# EAGLE design ds3231m-breakout (EAGLE 5.10)
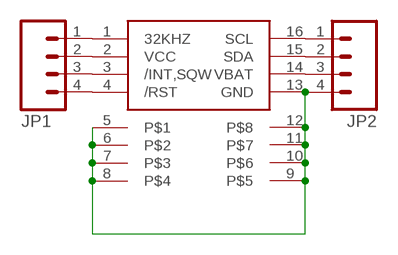
[diagram p0: schematic, sheet 1]

## Parts
JP1  M04LOCK_LONGPADS  [1X04_LOCK_LONGPADS]
JP2  M04LOCK_LONGPADS  [1X04_LOCK_LONGPADS]
U$1  DS3231M  [SO16W]

## Nets
N$1: JP1.1 U$1.1(32KHZ)
N$2: JP1.2 U$1.2(VCC)
N$3: JP1.3 U$1.3(/INT,SQW)
N$4: JP1.4 U$1.4(/RST)
N$5: JP2.1 U$1.16(SCL)
N$6: JP2.2 U$1.15(SDA)
N$7: JP2.3 U$1.14(VBAT)
N$9: JP2.4 U$1.5 U$1.6 U$1.7 U$1.8 U$1.9 U$1.10 U$1.11 U$1.12 U$1.13(GND)

## Library data of the parts
JP1 JP2 = SparkFun:M04: Header 4 Standard 4-pin 0.1" header. Use with straight break away headers (SKU : PRT-00116), right angle break away headers (PRT-00553), swiss pins (PRT-00743), machine pins (PRT-00117), and female headers (PRT-00115). Molex polarized connector foot print use with SKU : PRT-08231 with associated crimp pins and housings.
U$1 = ideabot:DS3231M

## Board
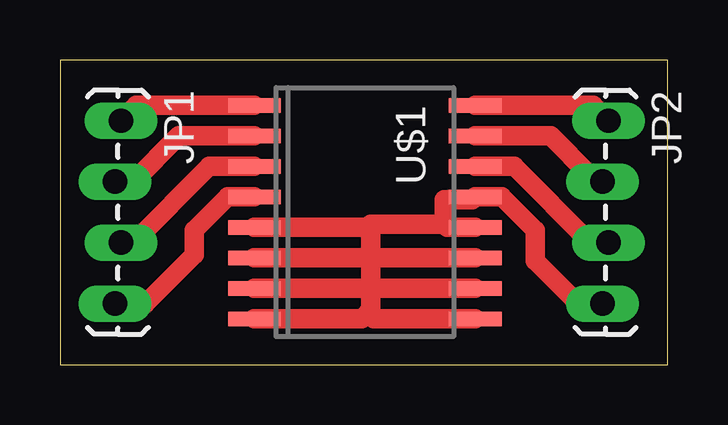
[diagram p1: board, top side]

Size 25.32 x 12.69 mm. Coordinates in mm from the lower left corner, seen from the top.
Outline: 0,0 25.32,0 25.32,12.69 0,12.69 0,0
Copper layers (1*16): Top 0.035mm / dielectric 1.5mm / Bottom 0.035mm
Design rules "default": minimum track width 10mil, minimum drill 24mil, track to track 8mil, track to pad 8mil, pad to pad 8mil, via to via 8mil, smd to smd 8mil, copper to edge 40mil, drill to drill 8mil, minimum pad ring 10mil, minimum via ring 8mil, stop-mask expansion 4mil, vias tented up to drill 0mil, thermal gap 10mil

### Footprints (pad centres in the part's own frame; a part is rotated, then mirrored left to right if it is on the bottom)
1X04_LOCK_LONGPADS = drill 1.016 long: 1 0,0; 2 2.54,-0.254; 3 5.08,0; 4 7.62,-0.254
SO16W = smd 0.6 x 2.2: 1 -4.445,-4.6; 2 -3.175,-4.6; 3 -1.905,-4.6; 4 -0.635,-4.6; 5 0.635,-4.6; 6 1.905,-4.6; 7 3.175,-4.6; 8 4.445,-4.6; 9 4.445,4.6; 10 3.175,4.6; 11 1.905,4.6; 12 0.635,4.6; 13 -0.635,4.6; 14 -1.905,4.6; 15 -3.175,4.6; 16 -4.445,4.6

### Placement (x,y rotation side)
JP1  2.54,10.16 270 top
JP2  22.86,10.16 270 top
U$1  12.7,6.35 270 top

### Tracks (layer width: path | path; a pad name or v marks a point on that pad's centre or on a via)
N$1
  Top 0.813: U$1.1 3.17,10.79 JP1.1
N$2
  Top 0.813: U$1.2 4.95,9.53 3.05,7.62 JP1.2
N$3
  Top 0.813: U$1.3 6.22,8.26 3.05,5.08 JP1.3
N$4
  Top 0.813: U$1.4 6.99,6.99 5.59,5.59 5.59,4.57 3.56,2.54 JP1.4
N$5
  Top 0.813: U$1.16 22.23,10.79 JP2.1
N$6
  Top 0.813: U$1.15 20.45,9.53 22.1,7.87 22.35,7.87 JP2.2
N$7
  Top 0.813: U$1.14 18.92,8.26 22.1,5.08 JP2.3
N$9
  Top 0.813: U$1.8 12.57,1.9 12.83,2.16 | 12.83,2.16 12.95,2.29 12.95,3.05 | 12.95,3.05 12.95,3.3 | 12.95,3.3 12.95,4.32 | 12.95,4.32 12.95,4.57 | 12.95,4.57 12.95,5.59 | 12.95,5.59 12.95,5.84 16,5.84 | 16,5.84 16,6.86 17.17,6.86 U$1.13 18.41,6.99 19.81,5.59 19.81,4.32 21.59,2.54 JP2.4 | U$1.12 16.13,5.71 16,5.84 | U$1.11 13.08,4.44 12.95,4.57 | U$1.10 13.08,3.17 12.95,3.3 | U$1.9 13.08,1.9 12.83,2.16 | U$1.7 12.83,3.17 12.95,3.05 | U$1.6 12.83,4.44 12.95,4.32 | U$1.5 12.83,5.71 12.95,5.59